# Altium project bmplc.prjpcb
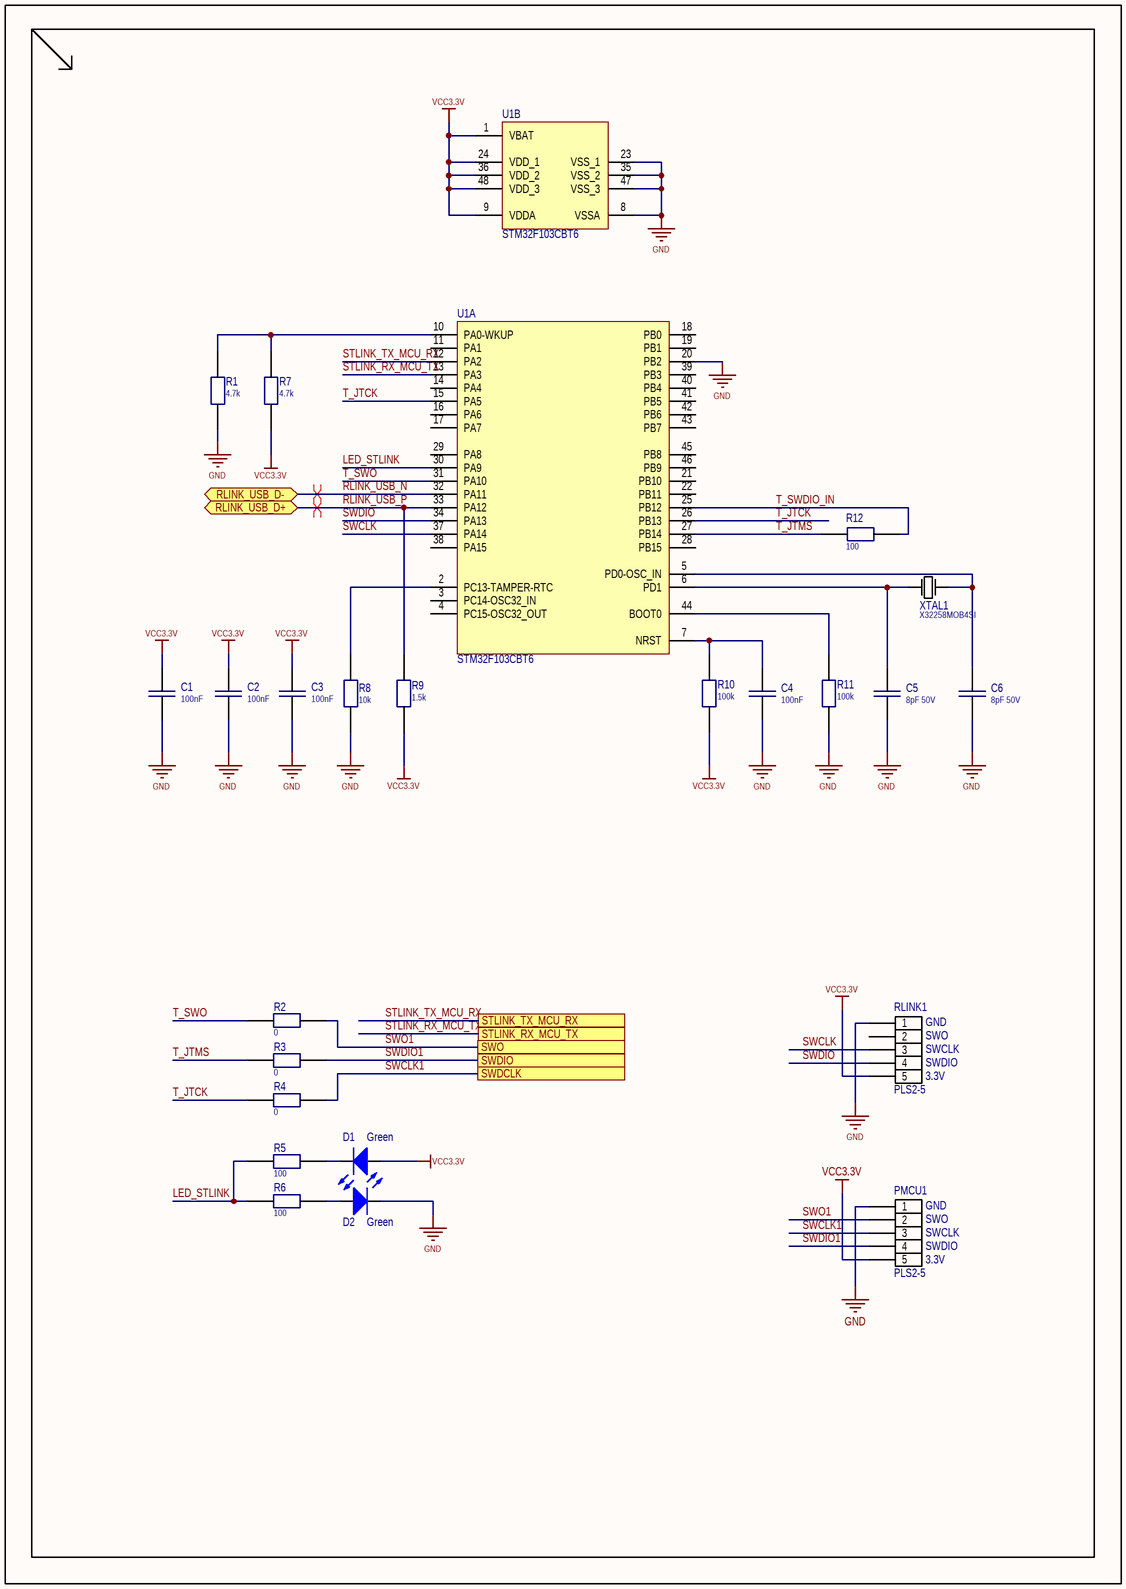
[diagram p0: rlink.schdoc]
6 sheets, 162 parts. Net scope: flat (ports and power ports of the same name join across sheets).
Board file: pcb.pcbdoc
Sheets:
  rlink.schdoc
  interfaces.schdoc
  usb.schdoc
  mcu.schdoc
  connections.schdoc
  dcdc.schdoc

## Sheet rlink.schdoc
size 209 x 297 mm; Scale: 1:1; DocumentType: Схема электрическая принципиальная; FirstReferrence: АБВГ.123456.001; PageSetup: Record=PageOptions|CenterHorizontal=False|CenterVertical=False|PrintScale=0.95|XCorrection=0.00|YCorrection=0.00|PrintKind=1|BorderSize=5000000|LeftOffset=0|BottomOffset=0|Orientation=1|PaperLength=1000|PaperWidth=1000|Scale=100|PaperSource=15|PrintQuality=600|MediaType=1|DitherType=10|PaperKind=A4|PrintScaleMode=1

### Parts
C1  100nF  [C_0603]
C2  100nF  [C_0603]
C3  100nF  [C_0603]
C4  100nF  [C_0603]
C5  8pF 50V  [C_0603]
C6  8pF 50V  [C_0603]
D1  Green  [LED_1206]
D2  Green  [LED_1206]
PMCU1  PLS2-5  [PLS-5-3D]  (no BOM)
R1  4.7k  [R_0603]
R2  0  [R_0603]
R3  0  [R_0603]
R4  0  [R_0603]
R5  100  [R_0603]
R6  100  [R_0603]
R7  4.7k  [R_0603]
R8  10k  [R_0603]
R9  1.5k  [R_0603]
R10  100k  [R_0603]
R11  100k  [R_0603]
R12  100  [R_0603]
RLINK1  PLS2-5  [PLS-5-3D]  (no BOM)
U1  STM32F103CBT6  [LQFP48_L]  (parts A,B of 2)
XTAL1  X32258MOB4SI  [NX3225GA]

### Ports
RLINK_USB_D+ (bidir), RLINK_USB_D- (bidir), STLINK_RX_MCU_TX, STLINK_TX_MCU_RX, SWDCLK, SWDIO, SWO

### Nets
GND: C1.1 C2.1 C3.1 C4.1 C5.1 C6.1 D2.2(K) PMCU1.1 R1.2 R8.2 R11.2 RLINK1.1 U1.8(VSSA) U1.20(PB2) U1.23(VSS_1) U1.35(VSS_2) U1.47(VSS_3)
VCC3.3V: C1.2 C2.2 C3.2 D1.1(A) PMCU1.5 R7.2 R9.2 R10.2 RLINK1.5 U1.1(VBAT) U1.9(VDDA) U1.24(VDD_1) U1.36(VDD_2) U1.48(VDD_3)
LED_STLINK: R5.2 R6.2 U1.30(PA9)
RLINK_USB_N: U1.32(PA11) ; port RLINK_USB_D-
RLINK_USB_P: R9.1 U1.33(PA12) ; port RLINK_USB_D+
STLINK_RX_MCU_TX: U1.13(PA3) ; port STLINK_RX_MCU_TX
STLINK_TX_MCU_RX: U1.12(PA2) ; port STLINK_TX_MCU_RX
SWCLK: RLINK1.3 U1.37(PA14)
SWCLK1: PMCU1.3 R4.1 ; port SWDCLK
SWDIO: RLINK1.4 U1.34(PA13)
SWDIO1: PMCU1.4 R3.1 ; port SWDIO
SWO1: PMCU1.2 R2.1 ; port SWO
T_JTCK: R4.2 U1.15(PA5) U1.26(PB13)
T_JTMS: R3.2 R12.2 U1.27(PB14)
T_SWDIO_IN: R12.1 U1.25(PB12)
T_SWO: R2.2 U1.31(PA10)
NetC4_2: C4.2 R10.1 U1.7(NRST)
NetC5_2: C5.2 U1.6(PD1) XTAL1.1(OSC1)
NetC6_2: C6.2 U1.5(PD0-OSC_IN) XTAL1.3(OSC2)
NetD1_2: D1.2(K) R5.1
NetD2_1: D2.1(A) R6.1
NetR1_1: R1.1 R7.1 U1.10(PA0-WKUP)
NetR8_1: R8.1 U1.2(PC13-TAMPER-RTC)
NetR11_1: R11.1 U1.44(BOOT0)

Not connected (* = marked no-connect by the designer): RLINK1 2; U1 3(PC14-OSC32_IN) 4(PC15-OSC32_OUT) 11(PA1) 14(PA4) 16(PA6) 17(PA7) 18(PB0) 19(PB1) 21(PB10) 22(PB11) 28(PB15) 29(PA8) 38(PA15) 39(PB3) 40(PB4) 41(PB5) 42(PB6) 43(PB7) 45(PB8) 46(PB9)

### Layout directives
differential pair: RLINK_USB_N, RLINK_USB_P

### Notes on the sheet
- (in symbol PLS2-5) GND; SWO; SWCLK; SWDIO; 3.3V

### Library data of the parts
C1-C4 = C0603: Capacitor; Part Number: CC0603JPX7R9BB104; Value: 100nF
C5 C6 = C0603: Capacitor; Part Number: CC0603DRNPO9BN8R0; Value: 8pF 50V
D1 D2 = LED_SMT_1206: Typical INFRARED GaAs LED; Part Number: KP-3216SGD; Value: *; Color: Green
PMCU1 RLINK1 = PLS2-5: Header, 5-Pin; Part Number: PLS-5; LatestRevisionDate: 17-Jul-2002; LatestRevisionNote: Re-released for DXP Platform.; Publisher: Altium Limited
R1 R7 = RES_SMD: Resistor; Part Number: RC0603FR-074K7L; Alternative Part: *; Value: 4.7k
R2-R4 = RES_SMD: Resistor; Part Number: RC0603FR-070RL; Alternative Part: *; Value: 0
R5 R6 R12 = RES_SMD: Resistor; Part Number: RC0603FR-07100RL; Alternative Part: *; Value: 100
R8 = RES_SMD: Resistor; Part Number: RC0603FR-0710KL; Alternative Part: *; Value: 10k
R9 = RES_SMD: Resistor; Part Number: RC0603FR-071K5L; Alternative Part: *; Value: 1.5k
R10 R11 = RES_SMD: Resistor; Part Number: RC0603FR-07100KL; Alternative Part: *; Value: 100k
U1 = STM32F103CBT6: STM32 ARM-based 32-bit MCU Performance Line with 128 kB Flash, 20 kB Internal RAM, -40 to +85°C Temperature, 48-Pin LQFP, Tray; DatasheetVersion: rev13.0, Apr-2011; PackageVersion: rev13, Apr-2011; PackageReference: LQFP48; PackageDescription: 48-Pin Low-Profile Quad Flat Pack, 7 x 7 mm Body, 0.5 mm Pitch (LQFP48); ComponentLink1Description: Manufacturer URL; ComponentLink1URL: http://www.st.com/; ComponentLink2Description: STM32F103 Datasheet; ComponentLink2URL: http://www.st.com/internet/com/TECHNICAL_RESOURCES/TECHNICAL_LITERATURE/DATASHEET/CD00161566.pdf; ComponentLink3Description: STM32 Family Web Page; ComponentLink3URL: www.st.com/stm32; Part Number: STM32F103CBT6
XTAL1 = NX3225GA: Crystal Oscillator; Part Number: X32258MOB4SI; Alternative Part: *

## Sheet interfaces.schdoc
size 209 x 297 mm; Scale: 1:1; DocumentType: Ñõåìà ýëåêòðè÷åñêàÿ ïðèíöèïèàëüíàÿ; FirstReferrence: ÀÁÂÃ.123456.001; PageSetup: Record=PageOptions¦CenterHorizontal=False¦CenterVertical=False¦PrintScale=0.95¦XCorrection=0.00¦YCorrection=0.00¦PrintKind=1¦BorderSize=5000000¦LeftOffset=0¦BottomOffset=0¦Orientation=1¦PaperLength=1000¦PaperWidth=1000¦Scale=100¦PaperSource=15¦PrintQuality=600¦MediaType=1¦DitherType=10¦PaperKind=A4¦PrintScaleMode=1
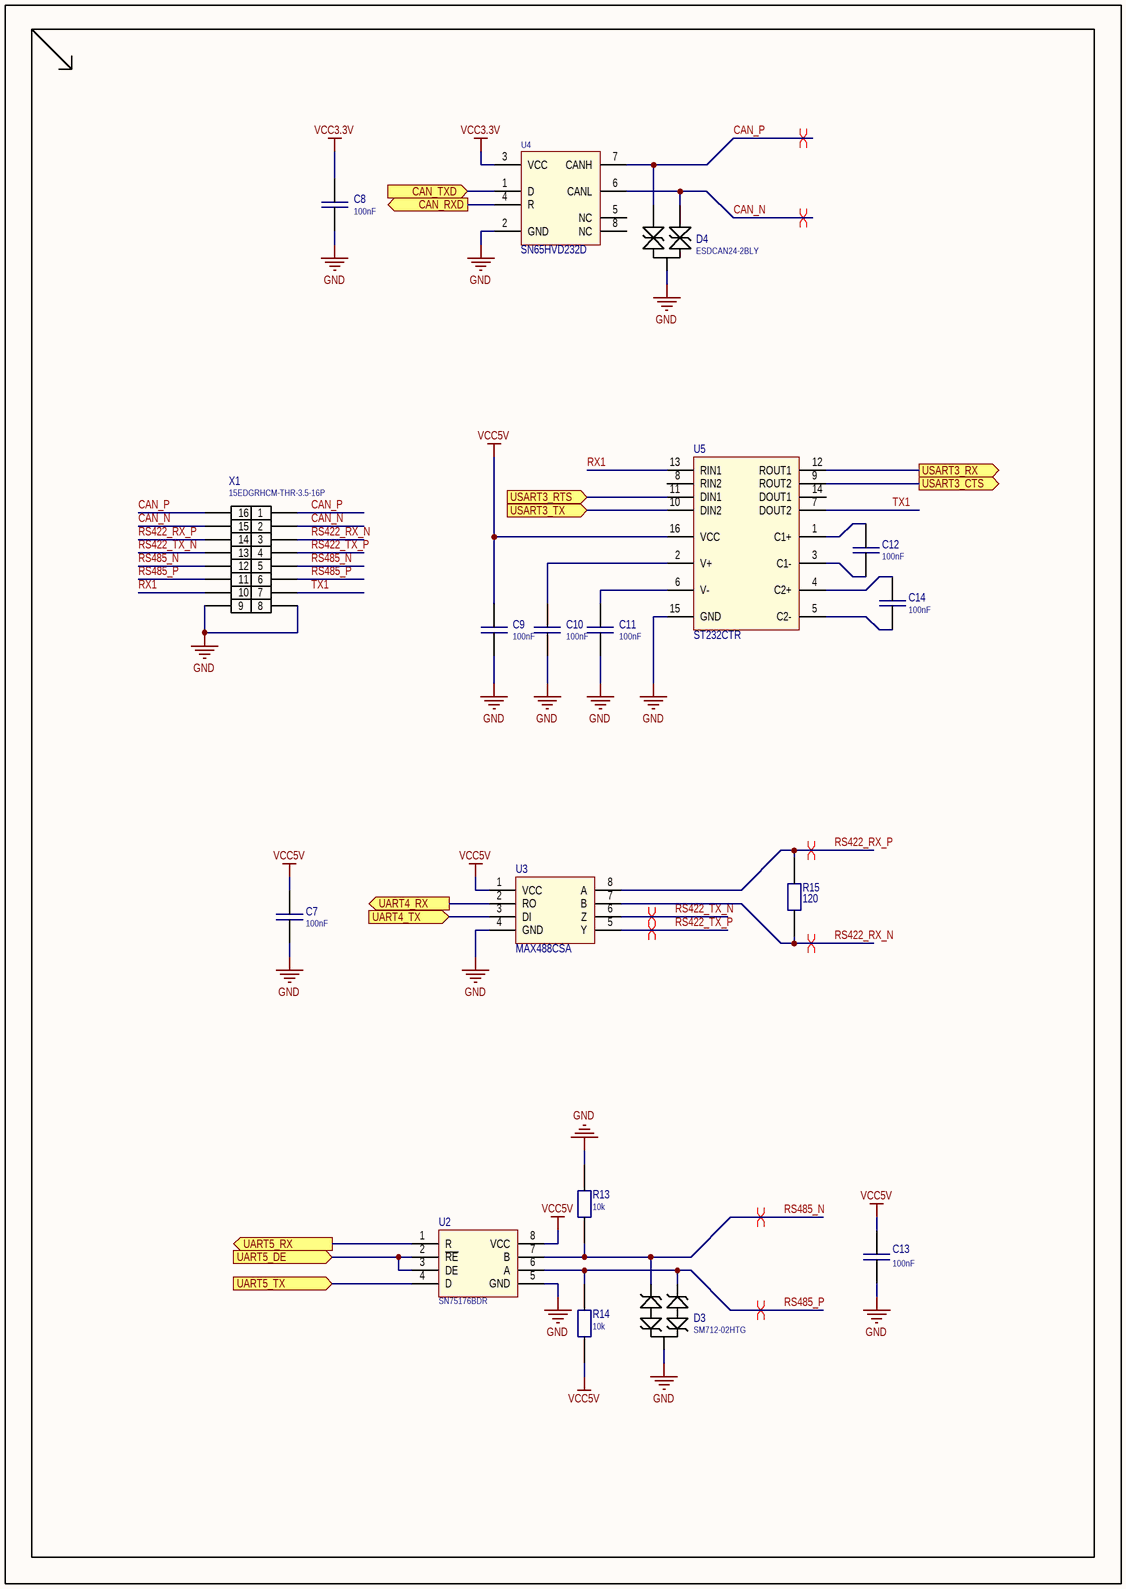
[diagram p1: interfaces.schdoc]

### Parts
C7  100nF  [C_0603]
C8  100nF  [C_0603]
C9  100nF  [C_0603]
C10  100nF  [C_0603]
C11  100nF  [C_0603]
C12  100nF  [C_0603]
C13  100nF  [C_0603]
C14  100nF  [C_0603]
D3  SM712-02HTG  [SOT23]
D4  ESDCAN24-2BLY  [SOT23]
R13  10k  [R_0603]
R14  10k  [R_0603]
R15  120  [R_0603]
U2  SN75176BDR  [SO-8]
U3  MAX488CSA  [SO-8_M]
U4  SN65HVD232D  [SO-8_M]
U5  ST232CTR  [TSSOP16_STM]
X1  15EDGRHCM-THR-3.5-16P  [DMC 1,5/ 8-G1F-3,5-LR P20THR / 1787072]

### Ports
CAN_RXD (out), CAN_TXD (in), UART4_RX (out), UART4_TX (in), UART5_DE (in), UART5_RX (out), UART5_TX (in), USART3_CTS (out), USART3_RTS (in), USART3_RX (out), USART3_TX (in)

### Nets
GND: C7.1 C8.1 C9.1 C10.1 C11.1 C13.1 D3.3 D4.3 R13.2 U2.5(GND) U3.4(GND) U4.2(GND) U5.15(GND) X1.8 X1.9
VCC3.3V: C8.2 U4.3(VCC)
VCC5V: C7.2 C9.2 C13.2 R14.1 U2.8(VCC) U3.1(VCC) U5.16(VCC)
CAN_N: D4.2 U4.6(CANL) X1.2 X1.15
CAN_P: D4.1 U4.7(CANH) X1.1 X1.16
RS422_RX_N: R15.2 U3.7(B) X1.3
RS422_RX_P: R15.1 U3.8(A) X1.14
RS422_TX_N: U3.6(Z) X1.13
RS422_TX_P: U3.5(Y) X1.4
RS485_N: D3.1 R13.1 U2.7(B) X1.5 X1.12
RS485_P: D3.2 R14.2 U2.6(A) X1.6 X1.11
RX1: U5.13(RIN1) X1.10
TX1: U5.7(DOUT2) X1.7
NetC10_2: C10.2 U5.2(V+)
NetC11_2: C11.2 U5.6(V-)
NetC12_1: C12.1 U5.1(C1+)
NetC12_2: C12.2 U5.3(C1-)
NetC14_1: C14.1 U5.4(C2+)
NetC14_2: C14.2 U5.5(C2-)
NetU2_1: U2.1(R) ; port UART5_RX
NetU2_2: U2.2(~{RE}) U2.3(DE) ; port UART5_DE
NetU2_4: U2.4(D) ; port UART5_TX
NetU3_2: U3.2(RO) ; port UART4_RX
NetU3_3: U3.3(DI) ; port UART4_TX
NetU4_1: U4.1(D) ; port CAN_TXD
NetU4_4: U4.4(R) ; port CAN_RXD
NetU5_9: U5.9(ROUT2) ; port USART3_CTS
NetU5_10: U5.10(DIN2) ; port USART3_TX
NetU5_11: U5.11(DIN1) ; port USART3_RTS
NetU5_12: U5.12(ROUT1) ; port USART3_RX

Not connected (* = marked no-connect by the designer): U4 5(NC) 8(NC); U5 8(RIN2) 14(DOUT1)

### Layout directives
differential pair: CAN_N, CAN_P, RS422_RX_N, RS422_RX_P, RS422_TX_N, RS422_TX_P, RS485_N, RS485_P

### Library data of the parts
C7-C14 = C0603: as C1 on sheet rlink; Value: 100nF
D3 = ESD: Value: SM712-02HTG; Part Number: SM712-02HTG; Alternative Part: *
D4 = ESD_CAN: ESD; Value: ESDCAN24-2BLY; Part Number: ESDCAN24-2BLY; Alternative Part: *
R13 R14 = RES_SMD: Resistor; Part Number: RC0603FR-0710KL; Alternative Part: *; Value: 10k
R15 = RES_SMD: Resistor; Part Number: RC0603FR-07120RL; Alternative Part: *; Value: 120
U2 = SN75176BDR: RS485 Half Duplex Convertor; Part Number: SN75176BDR
U3 = ADM4855ARZ: RS485 Full Duplex Convertor; Part Number: MAX488CSA
U4 = SN65HVD232D: CAN_transiever; Part Number: SN65HVD232DR; Alternative Part: XL1050
U5 = ST232CTR: No Description Available; Mfr_Name: STMicroelectronics; Alternative Part: SP3232EEY-L/TR; Copyright: Copyright (C) 2022 Ultra Librarian. All rights reserved.; Part Number: ST232CTR; RefDes: RefDes; Type: DEV
X1 = DMC 1,5/ 8-G1F-3,5-LR P20THR / 1787072: Part Number: 15EDGRHCM-THR-3.5-16P

## Sheet usb.schdoc: {Наименование}
size 209 x 297 mm; DocumentNumber: {Обозначение}; SheetNumber: {}; SheetTotal: {}; PageSetup: Record=PageOptions|CenterHorizontal=False|CenterVertical=False|PrintScale=0.95|XCorrection=0.00|YCorrection=0.00|PrintKind=1|BorderSize=5000000|LeftOffset=0|BottomOffset=0|Orientation=1|PaperLength=1000|PaperWidth=1000|Scale=100|PaperSource=15|PrintQuality=600|MediaType=1|DitherType=10|PaperKind=A4|PrintScaleMode=1; Rule: PcbType=ProtelPcb
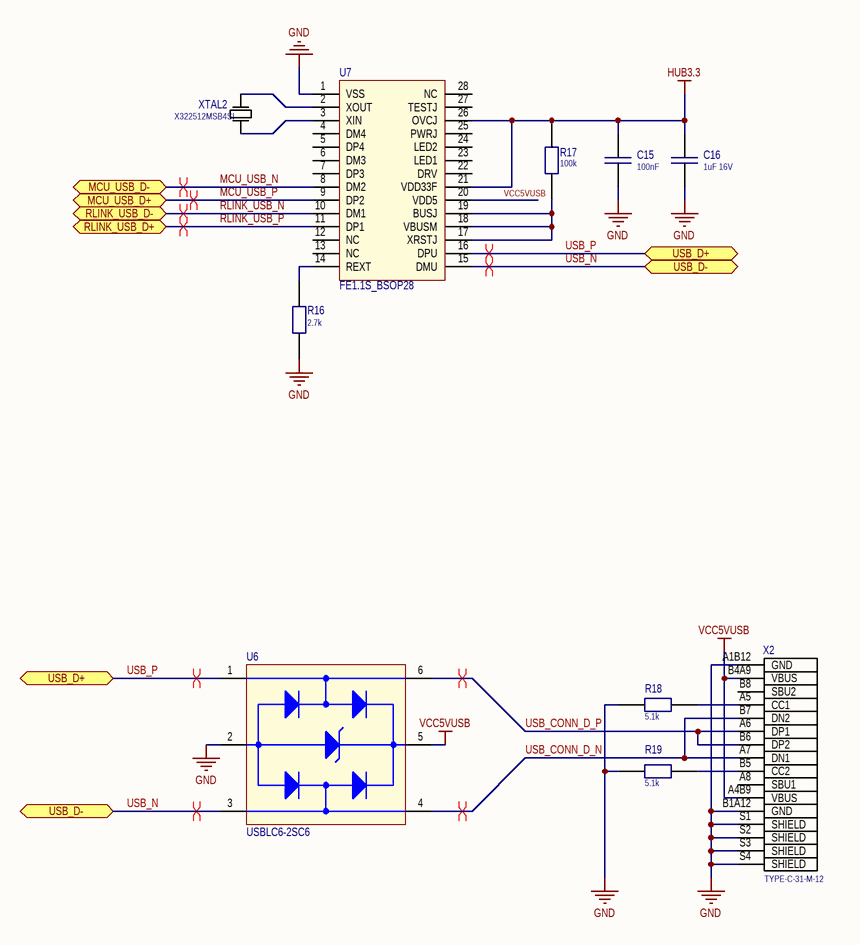
[diagram p2: usb.schdoc]

### Parts
C15  100nF  [C_0603]
C16  1uF 16V  [C_0603]
R16  2.7k  [R_0603]
R17  100k  [R_0603]
R18  5.1k  [R_0603]
R19  5.1k  [R_0603]
U6  USBLC6-2SC6  [SOT95P280X145-6N]
U7  FE1.1S_BSOP28  [BSOP28]
X2  TYPE-C-31-M-12  [HRO_TYPE-C-31-M-12]
XTAL2  X322512MSB4SI  [NX3225GA]

### Ports
MCU_USB_D+ (bidir), MCU_USB_D- (bidir), RLINK_USB_D+ (bidir), RLINK_USB_D- (bidir), USB_D+ (bidir), USB_D- (bidir)

### Nets
GND: C15.1 C16.1 R16.1 R18.1 R19.1 U6.2(GND) U7.1(VSS) X2.A1B12(GND) X2.B1A12(GND) X2.S1(SHIELD) X2.S2(SHIELD) X2.S3(SHIELD) X2.S4(SHIELD)
HUB3.3: C15.2 C16.2 R17.2 U7.21(VDD33F) U7.26(OVCJ)
VCC5VUSB: U6.5(VBUS) U7.20(VDD5) X2.A4B9(VBUS) X2.B4A9(VBUS)
MCU_USB_N: U7.8(DM2) ; port MCU_USB_D-
MCU_USB_P: U7.9(DP2) ; port MCU_USB_D+
RLINK_USB_N: U7.10(DM1) ; port RLINK_USB_D-
RLINK_USB_P: U7.11(DP1) ; port RLINK_USB_D+
USB_CONN_D_N: U6.4(I/O2_OUT) X2.A7(DN1) X2.B7(DN2)
USB_CONN_D_P: U6.6(I/O1_OUT) X2.A6(DP1) X2.B6(DP2)
USB_N: U6.3(I/O2_IN) U7.15(DMU) ; port USB_D-
USB_P: U6.1(I/O1_IN) U7.16(DPU) ; port USB_D+
NetR16_2: R16.2 U7.14(REXT)
NetR17_1: R17.1 U7.17(XRSTJ) U7.18(VBUSM) U7.19(BUSJ)
NetR18_2: R18.2 X2.A5(CC1)
NetR19_2: R19.2 X2.B5(CC2)
NetU7_2: U7.2(XOUT) XTAL2.1(OSC1)
NetU7_3: U7.3(XIN) XTAL2.3(OSC2)

Not connected (* = marked no-connect by the designer): U7 4(DM4) 5(DP4) 6(DM3) 7(DP3) 12(NC) 13(NC) 22(DRV) 23(LED1) 24(LED2) 25(PWRJ) 27(TESTJ) 28(NC); X2 A8(SBU1) B8(SBU2)

### Layout directives
differential pair: MCU_USB_N, MCU_USB_P, RLINK_USB_N, RLINK_USB_P, USB_CONN_D_N, USB_CONN_D_P, USB_N, USB_P

### Library data of the parts
C15 = C0603: as C1 on sheet rlink; Value: 100nF
C16 = C0603: Capacitor; Part Number: CC0603KRX7R7BB105; Value: 1uF 16V
R16 = RES_SMD: Resistor; Part Number: RC0603FR-072K7L; Alternative Part: *; Value: 2.7k
R17 = RES_SMD: Resistor; Part Number: RC0603FR-07100KL; Alternative Part: *; Value: 100k
R18 R19 = RES_SMD: Resistor; Part Number: RC0603JR-075K1L; Alternative Part: *; Value: 5.1k
U6 = USBLC6-2SC6: 17V Clamp 5A (8/20Âµs) Ipp Tvs Diode Surface Mount SOT-23-6; MF: STMicroelectronics; Value: *; Check_prices: https://www.snapeda.com/parts/USBLC6-2SC6/STMicroelectronics/view-part/?ref=eda; MP: USBLC6-2SC6; Purchase-URL: https://pricing.snapeda.com/search/part/USBLC6-2SC6/?ref=eda; Price: None; Availability: In Stock; Package: SOT-23-6 STMicroelectronics; SnapEDA_Link: https://www.snapeda.com/parts/USBLC6-2SC6/STMicroelectronics/view-part/?ref=snap; Part Number: USBLC6-2SC6; Alternative Part: *
U7 = FE1.1S_BSOP28: USB HUB 2.0; Part Number: FE1.1S-BSOP28BCN
X2 = TYPE-C-31-M-12: USB Connectors 24 Receptacle 1 8.94*7.3mm RoHS; Package: None; Availability: Unavailable; Value: *; MP: TYPE-C-31-M-12; Price: None; Part Number: TYPE-C-31-M-12; Alternative Part: *
XTAL2 = NX3225GA: Crystal Oscillator; Part Number: X322512MSB4SI; Alternative Part: *

## Sheet mcu.schdoc
size 209 x 297 mm; Scale: 1:1; DocumentType: Ñõåìà ýëåêòðè÷åñêàÿ ïðèíöèïèàëüíàÿ; FirstReferrence: ÀÁÂÃ.123456.001; Title1str: {Наименование}; PageSetup: Record=PageOptions¦CenterHorizontal=False¦CenterVertical=False¦PrintScale=0.95¦XCorrection=0.00¦YCorrection=0.00¦PrintKind=1¦BorderSize=5000000¦LeftOffset=0¦BottomOffset=0¦Orientation=1¦PaperLength=1000¦PaperWidth=1000¦Scale=100¦PaperSource=15¦PrintQuality=600¦MediaType=1¦DitherType=10¦PaperKind=A4¦PrintScaleMode=1; DocumentType1str: {Документ}; DocumentType2str: {Документ}
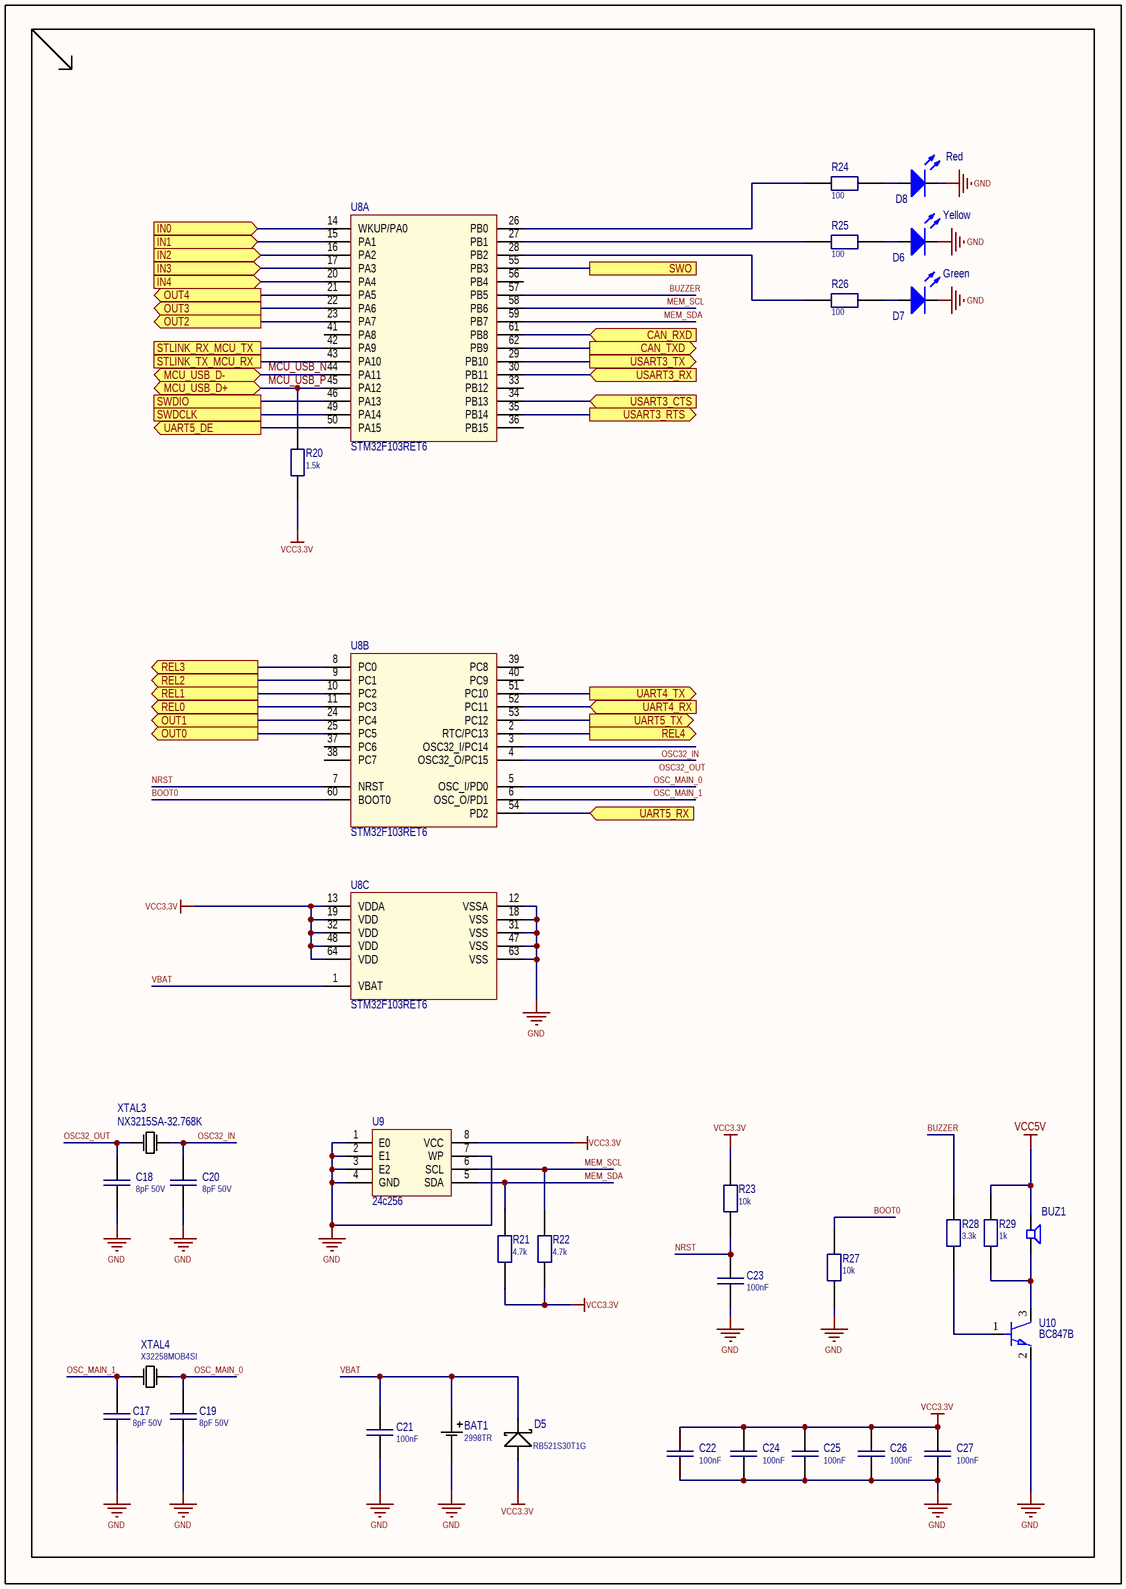
[diagram p3: mcu.schdoc]

### Parts
BAT1  2998TR  [BAT_2998TR]
BUZ1  L-KLS3-SMT-09X1.8  [SPKR_PKMCS0909E4000-R1]  (value not drawn)
C17  8pF 50V  [C_0603]
C18  8pF 50V  [C_0603]
C19  8pF 50V  [C_0603]
C20  8pF 50V  [C_0603]
C21  100nF  [C_0603]
C22  100nF  [C_0603]
C23  100nF  [C_0603]
C24  100nF  [C_0603]
C25  100nF  [C_0603]
C26  100nF  [C_0603]
C27  100nF  [C_0603]
D5  RB521S30T1G  [SOD-523]
D6  Yellow  [LED_1206]
D7  Green  [LED_1206]
D8  Red  [LED_1206]
R20  1.5k  [R_0603]
R21  4.7k  [R_0603]
R22  4.7k  [R_0603]
R23  10k  [R_0603]
R24  100  [R_0603]
R25  100  [R_0603]
R26  100  [R_0603]
R27  10k  [R_0603]
R28  3.3k  [R_0603]
R29  1k  [R_0603]
U8  STM32F103RET6  [LQFP64]  (parts A,B,C of 3)
U9  24c256  [SO-8_M]
U10  BC847B  [SOT23]
XTAL3  NX3215SA-32.768K  [XTAL_NX3215SA-32.768K-STD-MUA-8]
XTAL4  X32258MOB4SI  [NX3225GA]

### Ports
CAN_RXD (in), CAN_TXD (out), IN0 (in), IN1 (in), IN2 (in), IN3 (in), IN4 (in), MCU_USB_D+ (bidir), MCU_USB_D- (bidir), OUT0 (out), OUT1 (out), OUT2 (out), OUT3 (out), OUT4 (out), REL0 (out), REL1 (out), REL2 (out), REL3 (out), REL4 (out), STLINK_RX_MCU_TX, STLINK_TX_MCU_RX, SWDCLK, SWDIO, SWO, UART4_RX (in), UART4_TX (out), UART5_DE (out), UART5_RX (in), UART5_TX (out), USART3_CTS (in), USART3_RTS (out), USART3_RX (in), USART3_TX (out)

### Nets
GND: BAT1.N(-) C17.1 C18.1 C19.1 C20.1 C21.1 C22.1 C23.1 C24.1 C25.1 C26.1 C27.1 D6.2(K) D7.2(K) D8.2(K) R27.1 U8.12(VSSA) U8.18(VSS) U8.31(VSS) U8.47(VSS) U8.63(VSS) U9.1(E0) U9.2(E1) U9.3(E2) U9.4(GND) U9.7(WP) U10.2
VCC3.3V: C22.2 C24.2 C25.2 C26.2 C27.2 D5.2(A) R20.2 R21.2 R22.2 R23.2 U8.13(VDDA) U8.19(VDD) U8.32(VDD) U8.48(VDD) U8.64(VDD) U9.8(VCC)
VCC5V: BUZ1.1 R29.2
BOOT0: R27.2 U8.60(BOOT0)
BUZZER: R28.1 U8.57(PB5)
MCU_USB_N: U8.44(PA11) ; port MCU_USB_D-
MCU_USB_P: R20.1 U8.45(PA12) ; port MCU_USB_D+
MEM_SCL: R22.1 U8.58(PB6) U9.6(SCL)
MEM_SDA: R21.1 U8.59(PB7) U9.5(SDA)
NRST: C23.2 R23.1 U8.7(NRST)
OSC32_IN: C20.2 U8.3(OSC32_I/PC14) XTAL3.2(OSC2)
OSC32_OUT: C18.2 U8.4(OSC32_O/PC15) XTAL3.1(OSC1)
OSC_MAIN_0: C19.2 U8.5(OSC_I/PD0) XTAL4.3(OSC2)
OSC_MAIN_1: C17.2 U8.6(OSC_O/PD1) XTAL4.1(OSC1)
STLINK_RX_MCU_TX: U8.42(PA9) ; port STLINK_RX_MCU_TX
STLINK_TX_MCU_RX: U8.43(PA10) ; port STLINK_TX_MCU_RX
SWCLK1: U8.49(PA14) ; port SWDCLK
SWDIO1: U8.46(PA13) ; port SWDIO
SWO1: U8.55(PB3) ; port SWO
VBAT: BAT1.P1(+) C21.2 D5.1(K) U8.1(VBAT)
NetBUZ1_2: BUZ1.2 R29.1 U10.3
NetD6_1: D6.1(A) R25.1
NetD7_1: D7.1(A) R26.1
NetD8_1: D8.1(A) R24.1
NetR24_2: R24.2 U8.26(PB0)
NetR25_2: R25.2 U8.27(PB1)
NetR26_2: R26.2 U8.28(PB2)
NetR28_2: R28.2 U10.1
NetR35_1: U8.11(PC3) ; port REL0
NetR36_1: U8.10(PC2) ; port REL1
NetR37_1: U8.9(PC1) ; port REL2
NetR38_1: U8.8(PC0) ; port REL3
NetR39_1: U8.2(RTC/PC13) ; port REL4
NetR55_1: U8.14(WKUP/PA0) ; port IN0
NetR56_1: U8.15(PA1) ; port IN1
NetR57_1: U8.16(PA2) ; port IN2
NetR58_1: U8.17(PA3) ; port IN3
NetR59_1: U8.20(PA4) ; port IN4
NetR60_2: U8.21(PA5) ; port OUT4
NetR61_2: U8.25(PC5) ; port OUT0
NetR62_2: U8.24(PC4) ; port OUT1
NetR63_2: U8.23(PA7) ; port OUT2
NetR64_2: U8.22(PA6) ; port OUT3
NetU2_1: U8.54(PD2) ; port UART5_RX
NetU2_2: U8.50(PA15) ; port UART5_DE
NetU2_4: U8.53(PC12) ; port UART5_TX
NetU3_2: U8.52(PC11) ; port UART4_RX
NetU3_3: U8.51(PC10) ; port UART4_TX
NetU4_1: U8.62(PB9) ; port CAN_TXD
NetU4_4: U8.61(PB8) ; port CAN_RXD
NetU5_9: U8.34(PB13) ; port USART3_CTS
NetU5_10: U8.29(PB10) ; port USART3_TX
NetU5_11: U8.35(PB14) ; port USART3_RTS
NetU5_12: U8.30(PB11) ; port USART3_RX

Not connected (* = marked no-connect by the designer): U8 33(PB12) 36(PB15) 37(PC6) 38(PC7) 39(PC8) 40(PC9) 41(PA8) 56(PB4)

### Library data of the parts
BAT1 = 2998TR: Battery; Part Number: 2998TR
BUZ1 = BUZZER: Piezoelectric Sounders; Alternative Part: PKMCS0909E4000-R1; Part Number: L-KLS3-SMT-09X1.8
C17-C20 = C0603: as C5 on sheet rlink; Value: 8pF 50V
C21-C27 = C0603: as C1 on sheet rlink; Value: 100nF
D5 = D_SOD523: Diode; Part Number: RB521S30T1G; Alternative Part: *
D6 = LED_SMT_1206: Typical INFRARED GaAs LED; Part Number: KPT-3216SYC; Value: *; Color: Yellow
D7 = LED_SMT_1206: as D1 on sheet rlink; Value: *; Color: Green
D8 = LED_SMT_1206: Typical INFRARED GaAs LED; Part Number: KP-3216SRD; Value: *; Color: Red
R20 = RES_SMD: Resistor; Part Number: RC0603FR-071K5L; Alternative Part: *; Value: 1.5k
R21 R22 = RES_SMD: Resistor; Part Number: RC0603FR-074K7L; Alternative Part: *; Value: 4.7k
R23 R27 = RES_SMD: Resistor; Part Number: RC0603FR-0710KL; Alternative Part: *; Value: 10k
R24-R26 = RES_SMD: Resistor; Part Number: RC0603FR-07100RL; Alternative Part: *; Value: 100
R28 = RES_SMD: Resistor; Part Number: RC0603FR-073K3L; Alternative Part: *; Value: 3.3k
R29 = RES_SMD: Resistor; Part Number: RC0603FR-071KL; Alternative Part: *; Value: 1k
U8 = STM32F103Rxx: High-density performance line Arm®-based 32-bit MCU with 256 to 512KB / Flash, USB, CAN, 11 timers, 3 ADCs, 13 communication interfaces; Part Number: STM32F103RET6
U9 = 24c256: 256-Kbit I2C-compatible Serial EEPROM; Part Number: AT24C256C
U10 = BC847B: 45V 200mW 200@2mA,5V 100mA NPN SOT-23-3 Bipolar (BJT); Part Number: BC847B
XTAL3 = NX3215SA-32.768K: Crystal Oscillator; Part Number: NX3215SA-32.768K-10PPM-45KOHM-6PF; Alternative Part: *
XTAL4 = NX3225GA: Crystal Oscillator; Part Number: X32258MOB4SI; Alternative Part: *

## Sheet connections.schdoc
size 209 x 297 mm; Scale: 1:1; DocumentType: Схема электрическая принципиальная; FirstReferrence: АБВГ.123456.001; PageSetup: Record=PageOptions|CenterHorizontal=False|CenterVertical=False|PrintScale=0.95|XCorrection=0.00|YCorrection=0.00|PrintKind=1|BorderSize=5000000|LeftOffset=0|BottomOffset=0|Orientation=1|PaperLength=1000|PaperWidth=1000|Scale=100|PaperSource=15|PrintQuality=600|MediaType=1|DitherType=10|PaperKind=A4|PrintScaleMode=1
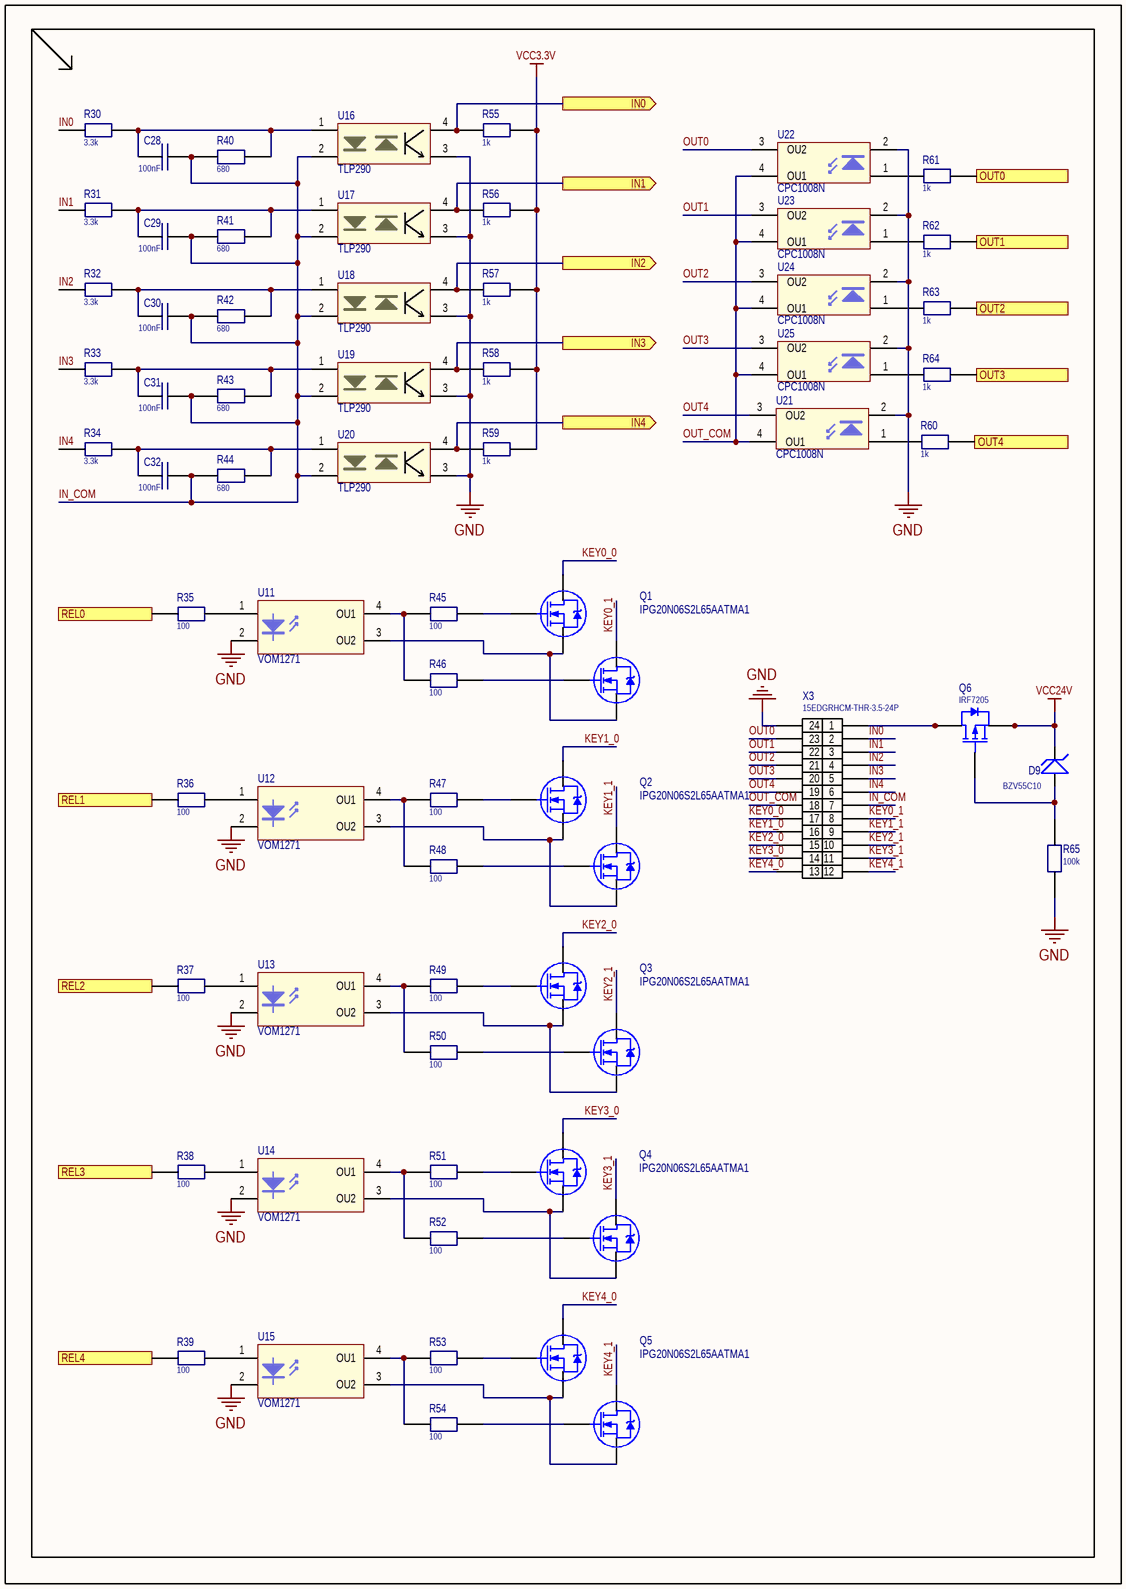
[diagram p4: connections.schdoc]

### Parts
C28  100nF  [C_0603]
C29  100nF  [C_0603]
C30  100nF  [C_0603]
C31  100nF  [C_0603]
C32  100nF  [C_0603]
D9  BZV55C10  [SOD80C]
Q1  IPG20N06S2L65AATMA1  [PowerFlat 5x6]
Q2  IPG20N06S2L65AATMA1  [PowerFlat 5x6]
Q3  IPG20N06S2L65AATMA1  [PowerFlat 5x6]
Q4  IPG20N06S2L65AATMA1  [PowerFlat 5x6]
Q5  IPG20N06S2L65AATMA1  [PowerFlat 5x6]
Q6  IRF7205  [SO-8_M]
R30  3.3k  [R_0805]
R31  3.3k  [R_0805]
R32  3.3k  [R_0805]
R33  3.3k  [R_0805]
R34  3.3k  [R_0805]
R35  100  [R_0603]
R36  100  [R_0603]
R37  100  [R_0603]
R38  100  [R_0603]
R39  100  [R_0603]
R40  680  [R_0603]
R41  680  [R_0603]
R42  680  [R_0603]
R43  680  [R_0603]
R44  680  [R_0603]
R45  100  [R_0603]
R46  100  [R_0603]
R47  100  [R_0603]
R48  100  [R_0603]
R49  100  [R_0603]
R50  100  [R_0603]
R51  100  [R_0603]
R52  100  [R_0603]
R53  100  [R_0603]
R54  100  [R_0603]
R55  1k  [R_0603]
R56  1k  [R_0603]
R57  1k  [R_0603]
R58  1k  [R_0603]
R59  1k  [R_0603]
R60  1k  [R_0603]
R61  1k  [R_0603]
R62  1k  [R_0603]
R63  1k  [R_0603]
R64  1k  [R_0603]
R65  100k  [R_0603]
U11  VOM1271  [SOP-4]
U12  VOM1271  [SOP-4]
U13  VOM1271  [SOP-4]
U14  VOM1271  [SOP-4]
U15  VOM1271  [SOP-4]
U16  TLP290  [SO4_1.27]
U17  TLP290  [SO4_1.27]
U18  TLP290  [SO4_1.27]
U19  TLP290  [SO4_1.27]
U20  TLP290  [SO4_1.27]
U21  CPC1008N  [SO4_2_54]
U22  CPC1008N  [SO4_2_54]
U23  CPC1008N  [SO4_2_54]
U24  CPC1008N  [SO4_2_54]
U25  CPC1008N  [SO4_2_54]
X3  15EDGRHCM-THR-3.5-24P  [DMC 1,5/12-G1F-3,5-LRP20THRR72]

### Ports
IN0 (out), IN1 (out), IN2 (out), IN3 (out), IN4 (out), OUT0 (in), OUT1 (in), OUT2 (in), OUT3 (in), OUT4 (in), REL0 (in), REL1 (in), REL2 (in), REL3 (in), REL4 (in)

### Nets
GND: R65.2 U11.2(K) U12.2(K) U13.2(K) U14.2(K) U15.2(K) U16.3 U17.3 U18.3 U19.3 U20.3 U21.2(K) U22.2(K) U23.2(K) U24.2(K) U25.2(K) X3.24
VCC3.3V: R55.2 R56.2 R57.2 R58.2 R59.2
VCC24V: D9.2(K) Q6.1(S) Q6.2(S) Q6.3(S)
IN0: R30.1 X3.2
IN1: R31.1 X3.3
IN2: R32.1 X3.4
IN3: R33.1 X3.5
IN4: R34.1 X3.6
IN_COM: C28.1 C29.1 C30.1 C31.1 C32.1 R40.1 R41.1 R42.1 R43.1 R44.1 U16.2 U17.2 U18.2 U19.2 U20.2 X3.7
KEY0_0: Q1.3(D) X3.17
KEY0_1: Q1.6(D) X3.8
KEY1_0: Q2.3(D) X3.16
KEY1_1: Q2.6(D) X3.9
KEY2_0: Q3.3(D) X3.15
KEY2_1: Q3.6(D) X3.10
KEY3_0: Q4.3(D) X3.14
KEY3_1: Q4.6(D) X3.11
KEY4_0: Q5.3(D) X3.13
KEY4_1: Q5.6(D) X3.12
OUT0: U22.3(OU2) X3.23
OUT1: U23.3(OU2) X3.22
OUT2: U24.3(OU2) X3.21
OUT3: U25.3(OU2) X3.20
OUT4: U21.3(OU2) X3.19
OUT_COM: U21.4(OU1) U22.4(OU1) U23.4(OU1) U24.4(OU1) U25.4(OU1) X3.18
NetC28_2: C28.2 R30.2 R40.2 U16.1
NetC29_2: C29.2 R31.2 R41.2 U17.1
NetC30_2: C30.2 R32.2 R42.2 U18.1
NetC31_2: C31.2 R33.2 R43.2 U19.1
NetC32_2: C32.2 R34.2 R44.2 U20.1
NetD9_1: D9.1(A) Q6.4(G) R65.1
NetQ1_1: Q1.1(G) R45.2
NetQ1_2: Q1.2(S) Q1.5(S) U11.3(OU2)
NetQ1_4: Q1.4(G) R46.2
NetQ2_1: Q2.1(G) R47.2
NetQ2_2: Q2.2(S) Q2.5(S) U12.3(OU2)
NetQ2_4: Q2.4(G) R48.2
NetQ3_1: Q3.1(G) R49.2
NetQ3_2: Q3.2(S) Q3.5(S) U13.3(OU2)
NetQ3_4: Q3.4(G) R50.2
NetQ4_1: Q4.1(G) R51.2
NetQ4_2: Q4.2(S) Q4.5(S) U14.3(OU2)
NetQ4_4: Q4.4(G) R52.2
NetQ5_1: Q5.1(G) R53.2
NetQ5_2: Q5.2(S) Q5.5(S) U15.3(OU2)
NetQ5_4: Q5.4(G) R54.2
NetQ6_5: Q6.5(D) Q6.6(D) Q6.7(D) Q6.8(D) X3.1
NetR35_1: R35.1 ; port REL0
NetR35_2: R35.2 U11.1(A)
NetR36_1: R36.1 ; port REL1
NetR36_2: R36.2 U12.1(A)
NetR37_1: R37.1 ; port REL2
NetR37_2: R37.2 U13.1(A)
NetR38_1: R38.1 ; port REL3
NetR38_2: R38.2 U14.1(A)
NetR39_1: R39.1 ; port REL4
NetR39_2: R39.2 U15.1(A)
NetR45_1: R45.1 R46.1 U11.4(OU1)
NetR47_1: R47.1 R48.1 U12.4(OU1)
NetR49_1: R49.1 R50.1 U13.4(OU1)
NetR51_1: R51.1 R52.1 U14.4(OU1)
NetR53_1: R53.1 R54.1 U15.4(OU1)
NetR55_1: R55.1 U16.4 ; port IN0
NetR56_1: R56.1 U17.4 ; port IN1
NetR57_1: R57.1 U18.4 ; port IN2
NetR58_1: R58.1 U19.4 ; port IN3
NetR59_1: R59.1 U20.4 ; port IN4
NetR60_1: R60.1 U21.1(A)
NetR60_2: R60.2 ; port OUT4
NetR61_1: R61.1 U22.1(A)
NetR61_2: R61.2 ; port OUT0
NetR62_1: R62.1 U23.1(A)
NetR62_2: R62.2 ; port OUT1
NetR63_1: R63.1 U24.1(A)
NetR63_2: R63.2 ; port OUT2
NetR64_1: R64.1 U25.1(A)
NetR64_2: R64.2 ; port OUT3

### Library data of the parts
C28-C32 = C0603: as C1 on sheet rlink; Value: 100nF
D9 = DZ_SOD80: Diode; Part Number: BZV55C10
Q1-Q5 = N-ch Dual PowerFLAT 5x6_1: Dual N-ch Mosfet; Part Number: IPG20N06S2L65AATMA1
Q6 = P-ch_SO8: 30V P-Channel  MOSFET; Part Number: IRF7205TRPBF
R30-R34 = RES_SMD: Resistor; Part Number: RC0805FR-073K3L; Alternative Part: *; Value: 3.3k
R35-R39 R45-R54 = RES_SMD: Resistor; Part Number: RC0603FR-07100RL; Alternative Part: *; Value: 100
R40-R44 = RES_SMD: Resistor; Part Number: RC0603FR-07680RL; Alternative Part: *; Value: 680
R55-R64 = RES_SMD: Resistor; Part Number: RC0603FR-071KL; Alternative Part: *; Value: 1k
R65 = RES_SMD: Resistor; Part Number: RC0603FR-07100KL; Alternative Part: *; Value: 100k
U11-U15 = VOM1271: Photovoltaic MOSFET Driver; Part Number: VOM1271T; Alternative Part: *
U16-U20 = TLP290: 4-Pin Phototransistor Optocoupler; Part Number: TLP290[GB.SE; Published: 24-Mar-1999; LatestRevisionDate: 04-Mar-2005; LatestRevisionNote: Sch pins 3 & 4 Swapped.; DatasheetVersion: Nov-2003; PackageReference: SO-4; Publisher: Altium Limited; Alternative Part: *
U21-U25 = OptoMOS_SO4: 4-Pin Phototransistor Optocoupler; Part Number: CPC1008NTR; Published: 24-Mar-1999; LatestRevisionDate: 04-Mar-2005; LatestRevisionNote: Sch pins 3 & 4 Swapped.; DatasheetVersion: Nov-2003; PackageReference: SO-4; Publisher: Altium Limited; Alternative Part: *
X3 = DMC 1,5/12-G1F-3,5-LRP20THRR72 / 1706067: Part Number: 15EDGRHCM-THR-3.5-24P

## Sheet dcdc.schdoc
size 209 x 297 mm; PageSetup: Record=PageOptions|CenterHorizontal=False|CenterVertical=False|PrintScale=0.95|XCorrection=0.00|YCorrection=0.00|PrintKind=1|BorderSize=5000000|LeftOffset=0|BottomOffset=0|Orientation=1|PaperLength=1000|PaperWidth=1000|Scale=100|PaperSource=15|PrintQuality=600|MediaType=1|DitherType=10|PaperKind=A4|PrintScaleMode=1
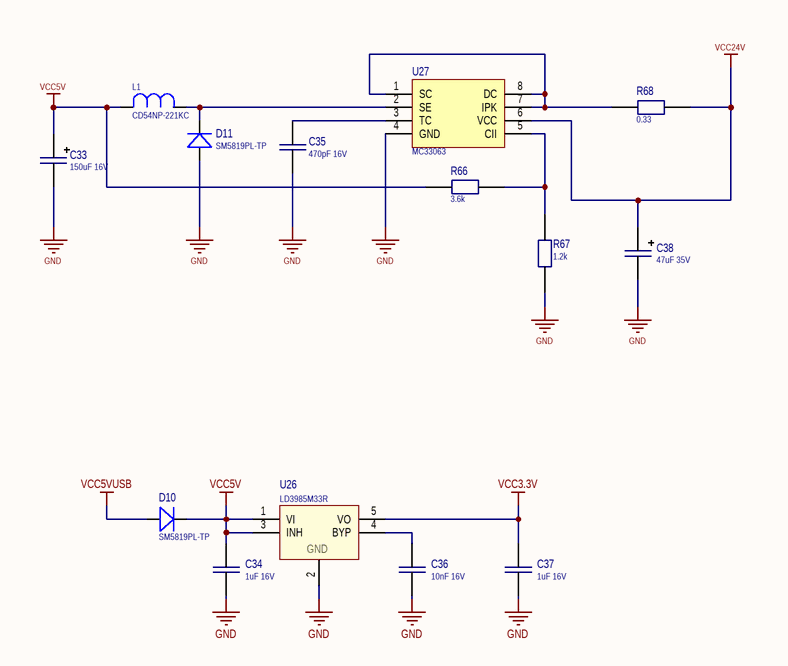
[diagram p5: dcdc.schdoc]

### Parts
C33  150uF 16V  [TANTAL_TYPE_D]
C34  1uF 16V  [C_0603]
C35  470pF 16V  [C_0603]
C36  10nF 16V  [C_0603]
C37  1uF 16V  [C_0603]
C38  47uF 35V  [TANTAL_TYPE_X]
D10  SM5819PL-TP  [SOD-123]
D11  SM5819PL-TP  [SOD-123]
L1  CD54NP-221KC  [CD54NP]
R66  3.6k  [R_0603]
R67  1.2k  [R_0603]
R68  0.33  [R_1206]
U26  LD3985M33R  [SOT23-5]
U27  MC33063  [SO-8]

### Nets
GND: C33.2 C34.1 C35.1 C36.1 C37.1 C38.2 D11.1(A) R67.1 U26.2(GND) U27.4(GND)
VCC3.3V: C37.2 U26.5(VO)
VCC5V: C33.1 C34.2 D10.2(K) L1.2 R66.1 U26.1(VI) U26.3(INH)
VCC5VUSB: D10.1(A)
VCC24V: C38.1 R68.1 U27.6(VCC)
NetC35_2: C35.2 U27.3(TC)
NetC36_2: C36.2 U26.4(BYP)
NetD11_2: D11.2(K) L1.1 U27.2(SE)
NetR66_2: R66.2 R67.2 U27.5(CII)
NetR68_2: R68.2 U27.1(SC) U27.7(IPK) U27.8(DC)

### Library data of the parts
C33 = TANTAL_CAP: Tantal Capacitor; Part Number: T491D157K016AT; Alternative Part: TAJD157K016RNJ; Value: 150uF 16V
C34 C37 = C0603: as C16 on sheet usb; Value: 1uF 16V
C35 = C0603: Capacitor; Part Number: CC0603KRX7R9BB471; Value: 470pF 16V
C36 = C0603: Capacitor; Part Number: CC0603JRX7R7BB103; Value: 10nF 16V
C38 = TANTAL_CAP: Tantal Capacitor; Part Number: T491X476K035AT; Alternative Part: *; Value: 47uF 35V
D10 D11 = D_SOD123: Diode; Part Number: SM5819PL-TP
L1 = L_CD54NP: Inductor; Alternative Part: SM5845-221MT; Value: CD54NP-221KC; Part Number: CD54NP-221KC
R66 = RES_SMD: Resistor; Part Number: RC0603FR-073K6L; Alternative Part: *; Value: 3.6k
R67 = RES_SMD: Resistor; Part Number: RC0603FR-071K2L; Alternative Part: *; Value: 1.2k
R68 = RES_SMD: Resistor; Part Number: RL1206FR-070R33L; Alternative Part: *; Value: 0.33
U26 = LD3985M33R: Ultra low drop and low noise BiCMOS voltage regulators; Part Number: LD3985M33R
U27 = MC33063: Step-up/down IC; Part Number: MC33063AP; Alternativr Part: *

## Nets that join several sheets
GND: rlink (17 pins), interfaces (15 pins), usb (13 pins), mcu (27 pins), connections (17 pins), dcdc (10 pins)
VCC3.3V: rlink (14 pins), interfaces (C8.2 U4.3), mcu (16 pins), connections (5 pins), dcdc (C37.2 U26.5)
VCC5V: interfaces (7 pins), mcu (BUZ1.1 R29.2), dcdc (7 pins)
VCC5VUSB: usb (U6.5 U7.20 X2.A4B9 X2.B4A9), dcdc (D10.1)
VCC24V: connections (D9.2 Q6.1 Q6.2 Q6.3), dcdc (C38.1 R68.1 U27.6)
MCU_USB_N: usb (U7.8), mcu (U8.44)
MCU_USB_P: usb (U7.9), mcu (R20.1 U8.45)
NetR35_1: mcu (U8.11), connections (R35.1)
NetR36_1: mcu (U8.10), connections (R36.1)
NetR37_1: mcu (U8.9), connections (R37.1)
NetR38_1: mcu (U8.8), connections (R38.1)
NetR39_1: mcu (U8.2), connections (R39.1)
NetR55_1: mcu (U8.14), connections (R55.1 U16.4)
NetR56_1: mcu (U8.15), connections (R56.1 U17.4)
NetR57_1: mcu (U8.16), connections (R57.1 U18.4)
NetR58_1: mcu (U8.17), connections (R58.1 U19.4)
NetR59_1: mcu (U8.20), connections (R59.1 U20.4)
NetR60_2: mcu (U8.21), connections (R60.2)
NetR61_2: mcu (U8.25), connections (R61.2)
NetR62_2: mcu (U8.24), connections (R62.2)
NetR63_2: mcu (U8.23), connections (R63.2)
NetR64_2: mcu (U8.22), connections (R64.2)
NetU2_1: interfaces (U2.1), mcu (U8.54)
NetU2_2: interfaces (U2.2 U2.3), mcu (U8.50)
NetU2_4: interfaces (U2.4), mcu (U8.53)
NetU3_2: interfaces (U3.2), mcu (U8.52)
NetU3_3: interfaces (U3.3), mcu (U8.51)
NetU4_1: interfaces (U4.1), mcu (U8.62)
NetU4_4: interfaces (U4.4), mcu (U8.61)
NetU5_9: interfaces (U5.9), mcu (U8.34)
NetU5_10: interfaces (U5.10), mcu (U8.29)
NetU5_11: interfaces (U5.11), mcu (U8.35)
NetU5_12: interfaces (U5.12), mcu (U8.30)
RLINK_USB_N: rlink (U1.32), usb (U7.10)
RLINK_USB_P: rlink (R9.1 U1.33), usb (U7.11)
STLINK_RX_MCU_TX: rlink (U1.13), mcu (U8.42)
STLINK_TX_MCU_RX: rlink (U1.12), mcu (U8.43)
SWCLK1: rlink (PMCU1.3 R4.1), mcu (U8.49)
SWDIO1: rlink (PMCU1.4 R3.1), mcu (U8.46)
SWO1: rlink (PMCU1.2 R2.1), mcu (U8.55)